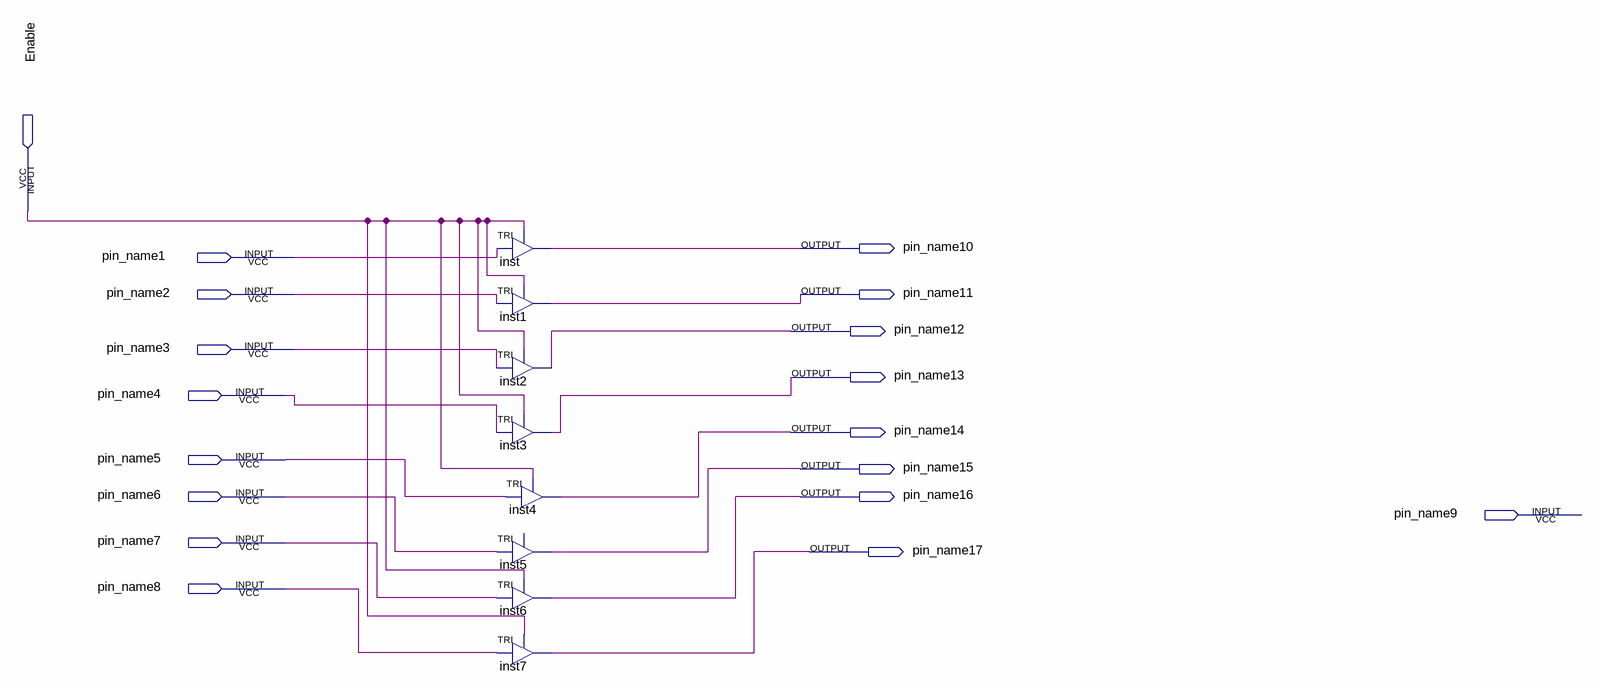
[diagram p0: schematic sheet]
// Quartus schematic Activador.bdf as structural Verilog: 8 symbols, 18 pins
module Activador (
  input  Enable,
  input  pin_name1,
  input  pin_name2,
  input  pin_name3,
  input  pin_name4,
  input  pin_name5,
  input  pin_name6,
  input  pin_name9,
  input  pin_name7,
  input  pin_name8,
  output pin_name10,
  output pin_name11,
  output pin_name12,
  output pin_name13,
  output pin_name14,
  output pin_name15,
  output pin_name16,
  output pin_name17
);

  TRI inst (.IN(pin_name1), .OE(Enable), .OUT(pin_name10));
  TRI inst1 (.IN(pin_name2), .OE(Enable), .OUT(pin_name11));
  TRI inst2 (.IN(pin_name3), .OE(Enable), .OUT(pin_name12));
  TRI inst3 (.IN(pin_name4), .OE(Enable), .OUT(pin_name13));
  TRI inst4 (.IN(pin_name5), .OE(Enable), .OUT(pin_name14));
  TRI inst5 (.IN(pin_name6), .OUT(pin_name15));  // open: OE
  TRI inst6 (.IN(pin_name7), .OE(Enable), .OUT(pin_name16));
  TRI inst7 (.IN(pin_name8), .OE(Enable), .OUT(pin_name17));
endmodule
